# Altium schematic sheet Hilt-Side Schematic.SchDoc
size Legal
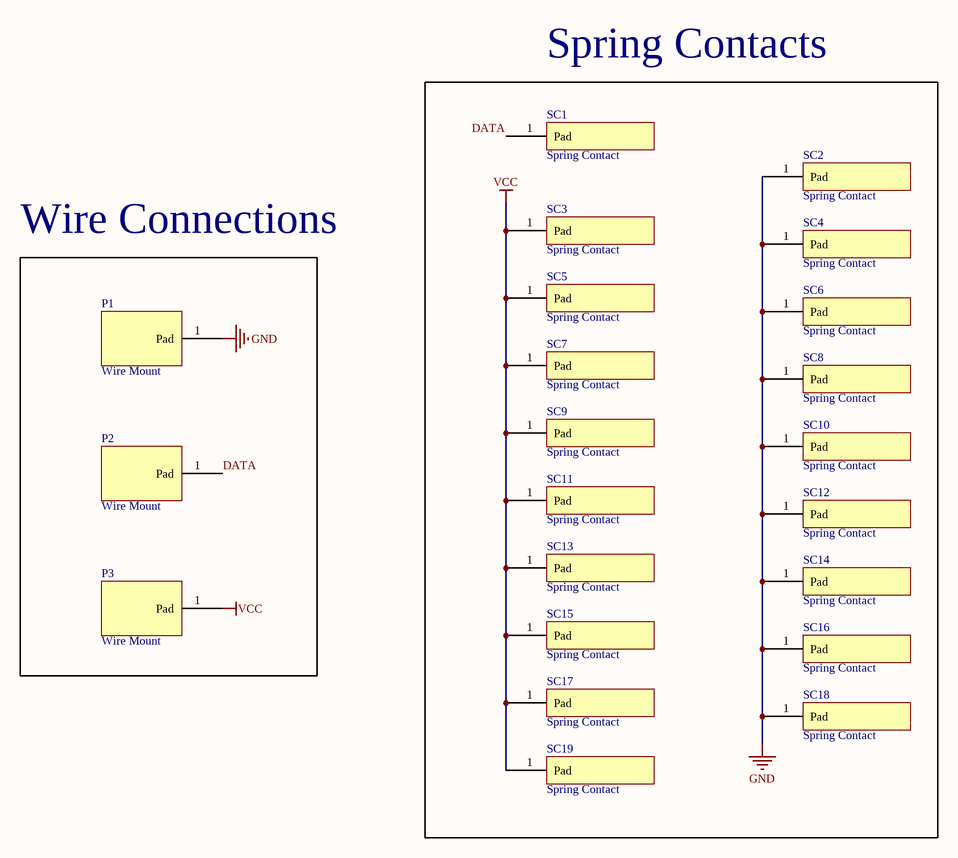
[diagram p0: Hilt-Side Schematic.SchDoc]

## Parts
P1  Wire Mount  [Wire Mount]
P2  Wire Mount  [Wire Mount]
P3  Wire Mount  [Wire Mount]
SC1  Spring Contact  [Spring Contact]
SC2  Spring Contact  [Spring Contact]
SC3  Spring Contact  [Spring Contact]
SC4  Spring Contact  [Spring Contact]
SC5  Spring Contact  [Spring Contact]
SC6  Spring Contact  [Spring Contact]
SC7  Spring Contact  [Spring Contact]
SC8  Spring Contact  [Spring Contact]
SC9  Spring Contact  [Spring Contact]
SC10  Spring Contact  [Spring Contact]
SC11  Spring Contact  [Spring Contact]
SC12  Spring Contact  [Spring Contact]
SC13  Spring Contact  [Spring Contact]
SC14  Spring Contact  [Spring Contact]
SC15  Spring Contact  [Spring Contact]
SC16  Spring Contact  [Spring Contact]
SC17  Spring Contact  [Spring Contact]
SC18  Spring Contact  [Spring Contact]
SC19  Spring Contact  [Spring Contact]

## Blocks framed on the sheet
Spring Contacts: SC1-SC19
Wire Connections: P1-P3

## Nets
GND: P1.1(Pad) SC2.1(Pad) SC4.1(Pad) SC6.1(Pad) SC8.1(Pad) SC10.1(Pad) SC12.1(Pad) SC14.1(Pad) SC16.1(Pad) SC18.1(Pad)
VCC: P3.1(Pad) SC3.1(Pad) SC5.1(Pad) SC7.1(Pad) SC9.1(Pad) SC11.1(Pad) SC13.1(Pad) SC15.1(Pad) SC17.1(Pad) SC19.1(Pad)
DATA: P2.1(Pad) SC1.1(Pad)